# Altium schematic sheet Optocoupler.SchDoc
size A4
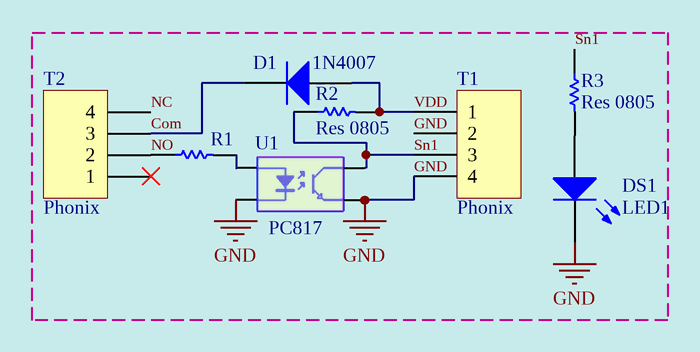
[diagram p0: Optocoupler.SchDoc]

## Parts
D1  1N4007  [Diod]
DS1  LED1  [LED1]
R1  Res 0805  [R0805]  (value not drawn)
R2  Res 0805  [R0805]
R3  Res 0805  [R0805]
T1  Phonix  [Phonix-4]
T2  Phonix  [Phonix-4]
U1  PC817  [OptoCupler]

## Nets
GND: DS1.K T1.2 T1.4 U1.2(K) U1.3(E)
Com: D1.K T2.3
NC: T2.4
NO: R1.2 T2.2
Sn1: R2.2 R3.2 T1.3 U1.4(C)
VDD: D1.A R2.1 T1.1
NetDS1_A: DS1.A R3.1
NetR1_1: R1.1 U1.1(A)

Not connected (* = marked no-connect by the designer): T2 1*

## Notes on the sheet
- Title
- Size:
- Data:
- CompanyName:
- A4
- Number:
- Time:
- Revision:
- Engineer:
- File:

## Library data of the parts
D1 = Diode
T1 T2 = Phonix-4
U1 = Optoisolator(smd)